# Altium schematic sheet РЕУН.468323.001_LED_DRV_ISO_1.SchDoc: =Name-1str
size 594 x 420 mm; SheetNumber: 6; Вид изделия: Документация; Раздел: Документация; Код документа: Э3; Вид документа: Схема электрическая принципиальная; Класс документа: Конструкторский документ; Создавать изделие в PLM: Yes; DocumentCode: РЕУН.468323.001 Э3 2D; DocumentView: Схема электрическая принципиальная; DocumentClass: Конструкторский документ; ProductView: Документация; Format: А2
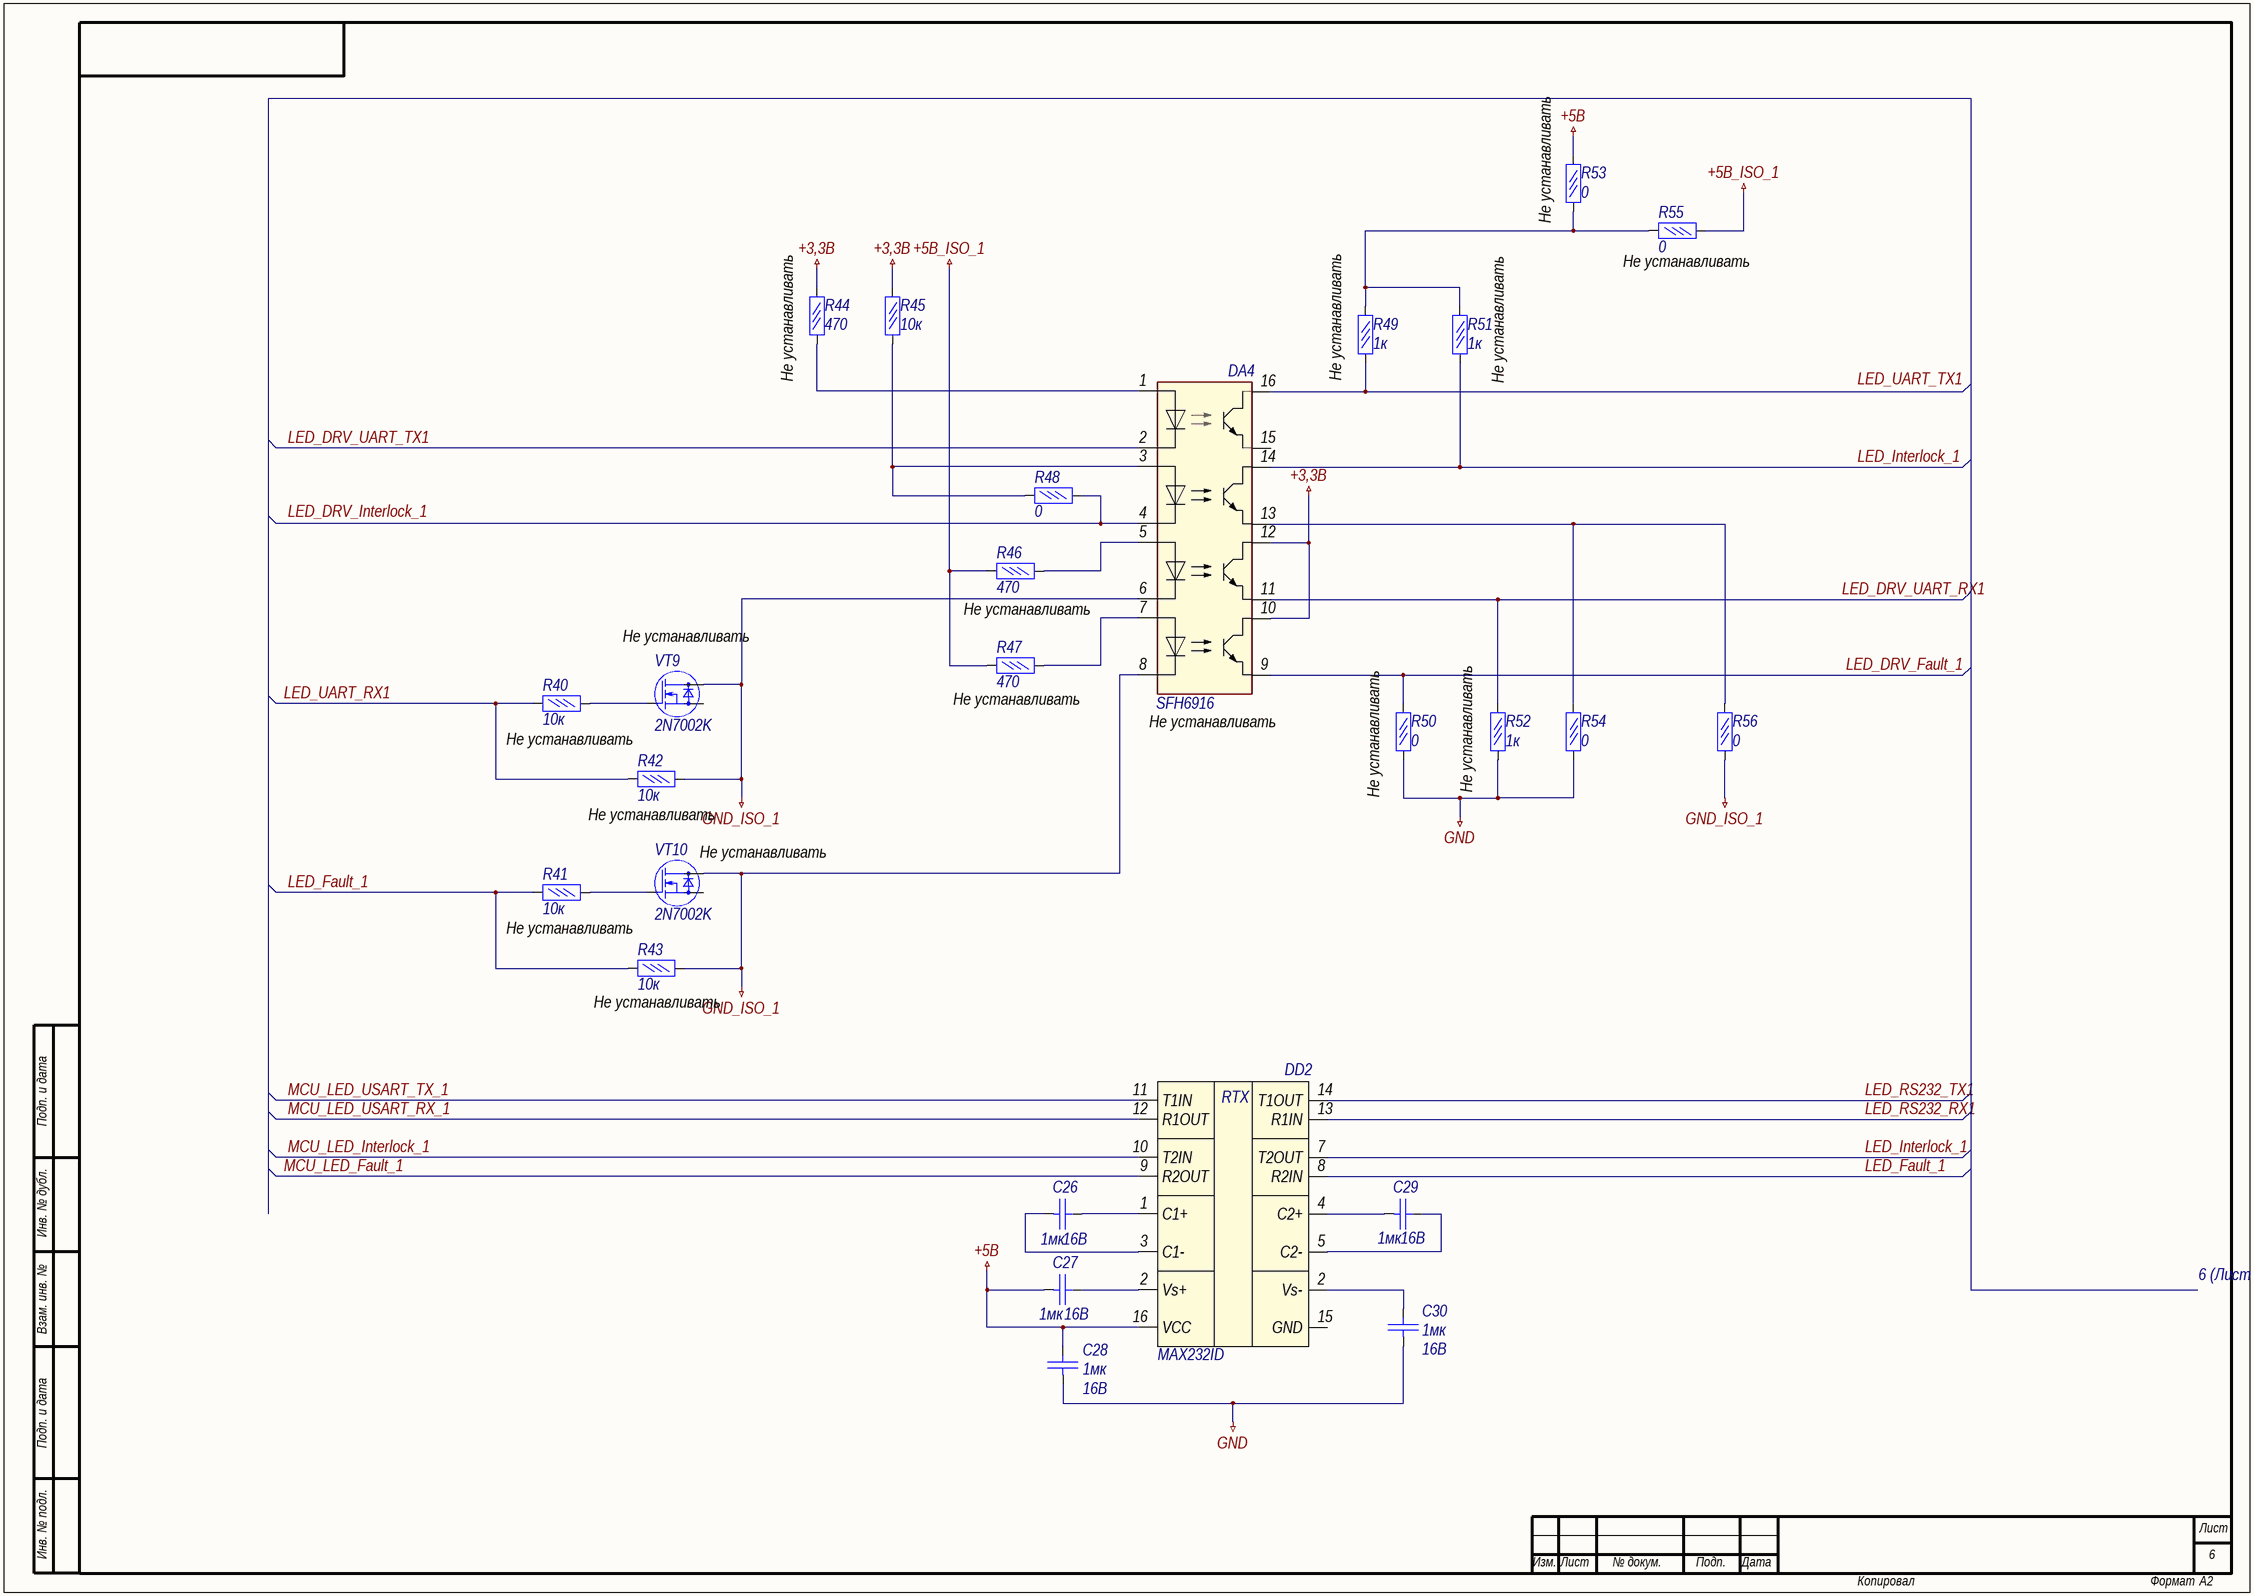
[diagram p0: РЕУН.468323.001_LED_DRV_ISO_1.SchDoc]

## Parts
C26  Voltage: 16В  [C0805_AA]  (hidden comment: 1мк)
C27  Voltage: 16В  [C0805_AA]  (hidden comment: 1мк)
C28  Voltage: 16В  [C0805_AA]  (hidden comment: 1мк)
C29  Voltage: 16В  [C0805_AA]  (hidden comment: 1мк)
C30  Voltage: 16В  [C0805_AA]  (hidden comment: 1мк)
DA4  SFH6916
DD2  MAX232ID
R40  10к  [R1206]
R41  10к  [R1206]
R42  10к  [R1206]
R43  10к  [R1206]
R44  470  [R1206]
R45  10к  [R1206]
R46  470  [R1206]
R47  470  [R1206]
R48  0  [R1206]
R49  1к  [R1206]
R50  0  [R1206]
R51  1к  [R1206]
R52  1к  [R1206]
R53  0  [R1206]
R54  0  [R1206]
R55  0  [R1206]
R56  0  [R1206]
VT9  2N7002K  [SOT23-3]
VT10  2N7002K  [SOT23-3]

## Nets
+3,3В: DA4.10 DA4.12 R44.1 R45.2
+5В: C27.2 C28.1 DD2.16(VCC) R53.1
+5В_ISO_1: R46.1 R47.1 R55.1
GND: C28.2 C30.2 R50.1 R52.1 R54.1
GND_ISO_1: DA4.6 DA4.8 R42.2 R43.2 R56.1 VT9.3(D) VT10.3(D)
LED_DRV_Fault_1: DA4.9 R50.2
LED_DRV_UART_RX1: DA4.11 R52.2
LED_DRV_UART_TX1: DA4.2
LED_Fault_1: DD2.8(R2IN) R41.1 R43.1
LED_Interlock_1: DA4.14 DD2.7(T2OUT) R51.1
LED_RS232_RX1: DD2.13(R1IN)
LED_RS232_TX1: DD2.14(T1OUT)
LED_UART_RX1: R40.1 R42.1
MCU_LED_Fault_1: DD2.9(R2OUT)
MCU_LED_Interlock_1: DD2.10(T2IN)
MCU_LED_USART_RX_1: DD2.12(R1OUT)
MCU_LED_USART_TX_1: DD2.11(T1IN)
NetC26_1: C26.1 DD2.1(C1+)
NetC26_2: C26.2 DD2.3(C1-)
NetC27_1: C27.1 DD2.2(Vs+)
NetC29_1: C29.1 DD2.5(C2-)
NetC29_2: C29.2 DD2.4(C2+)
NetC30_1: C30.1 DD2.2(Vs-)
NetDA4_1: DA4.1 R44.2
NetDA4_3: DA4.3 R45.1 R48.1
NetDA4_4: DA4.4 R48.2
NetDA4_5: DA4.5 R46.2
NetDA4_7: DA4.7 R47.2
NetDA4_13: DA4.13 R54.2 R56.2
NetDA4_16: DA4.16 R49.1
NetR40_2: R40.2 VT9.1(G)
NetR41_2: R41.2 VT10.1(G)
NetR49_2: R49.2 R51.2 R53.2 R55.2

Not connected (* = marked no-connect by the designer): DA4 15; DD2 15(GND); VT9 2(S); VT10 2(S)

## Notes on the sheet
- (near R53) Не устанавливать
- (near R55) Не устанавливать
- (near R44) Не устанавливать
- (near R49) Не устанавливать
- (near R51) Не устанавливать
- (near VT9) Не устанавливать
- Не устанавливать
- (near R47) Не устанавливать
- (near DA4) Не устанавливать
- (near R50) Не устанавливать
- (near R52) Не устанавливать
- (near R42) Не устанавливать
- (near VT10) Не устанавливать
- (near R43) Не устанавливать
- 6 (Лист 1, 3, 4, 5, 7, 8, 9, 10, 11, 12)
- Labels drawn without touching a wire or pin: LED_DRV_Interlock_1, LED_UART_TX1
- Подп. и дата
- Инв. № дубл.
- Взам. инв. №
- Инв. № подл.
- Лист
- Изм.
- № докум.
- Подп.
- Дата
- Копировал
- Формат
- (in symbol MAX232ID) RTX

## Library data of the parts
C26-C30 = Конденсатор кер.: Name: CC0603KRX7R7BB105; Value: 1мк
DA4 = OPTO-4: Опторазвязка х4
DD2 = MAX232ID: Dual EIA-232 Drivers/Receivers
R40-R56 = Резистор  0,05Вт: Резистор 0,05Вт; Power rating: 0,05Вт
  R40-R43 R45: Value: 10к
  R44 R46 R47: Value: 470
  R48 R50 R53-R56: Value: 0
  R49 R51 R52: Value: 1к
VT9 VT10 = mosfet-n: Name: 2N7002K